# Altium schematic sheet Standby_PS.SchDoc
size A1; SPICEModelCacheYQEDCYZF: <root> / <DocumentId>YQEDCYZF</DocumentId> / </root>
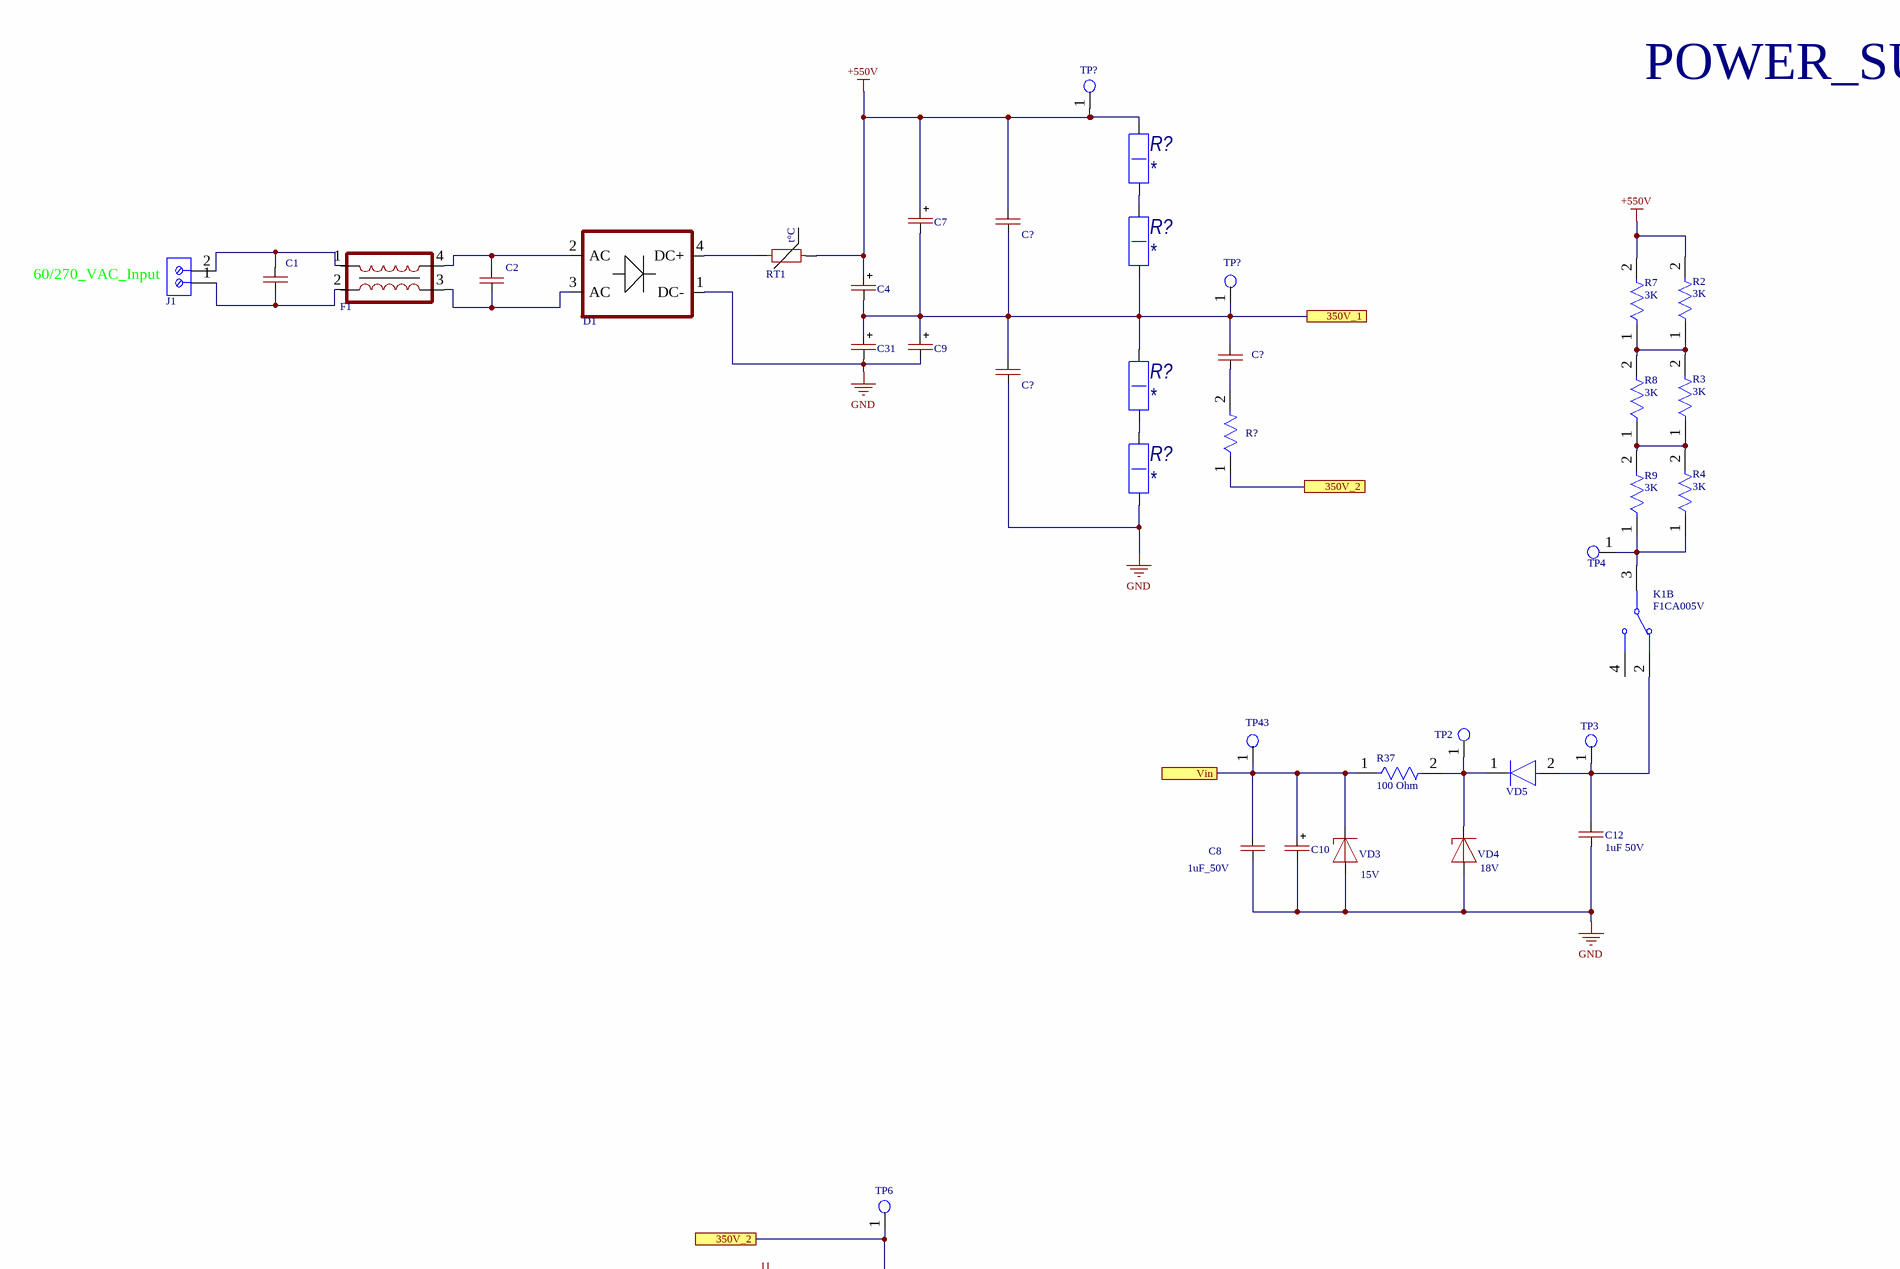
[diagram p0: Standby_PS.SchDoc, top left]
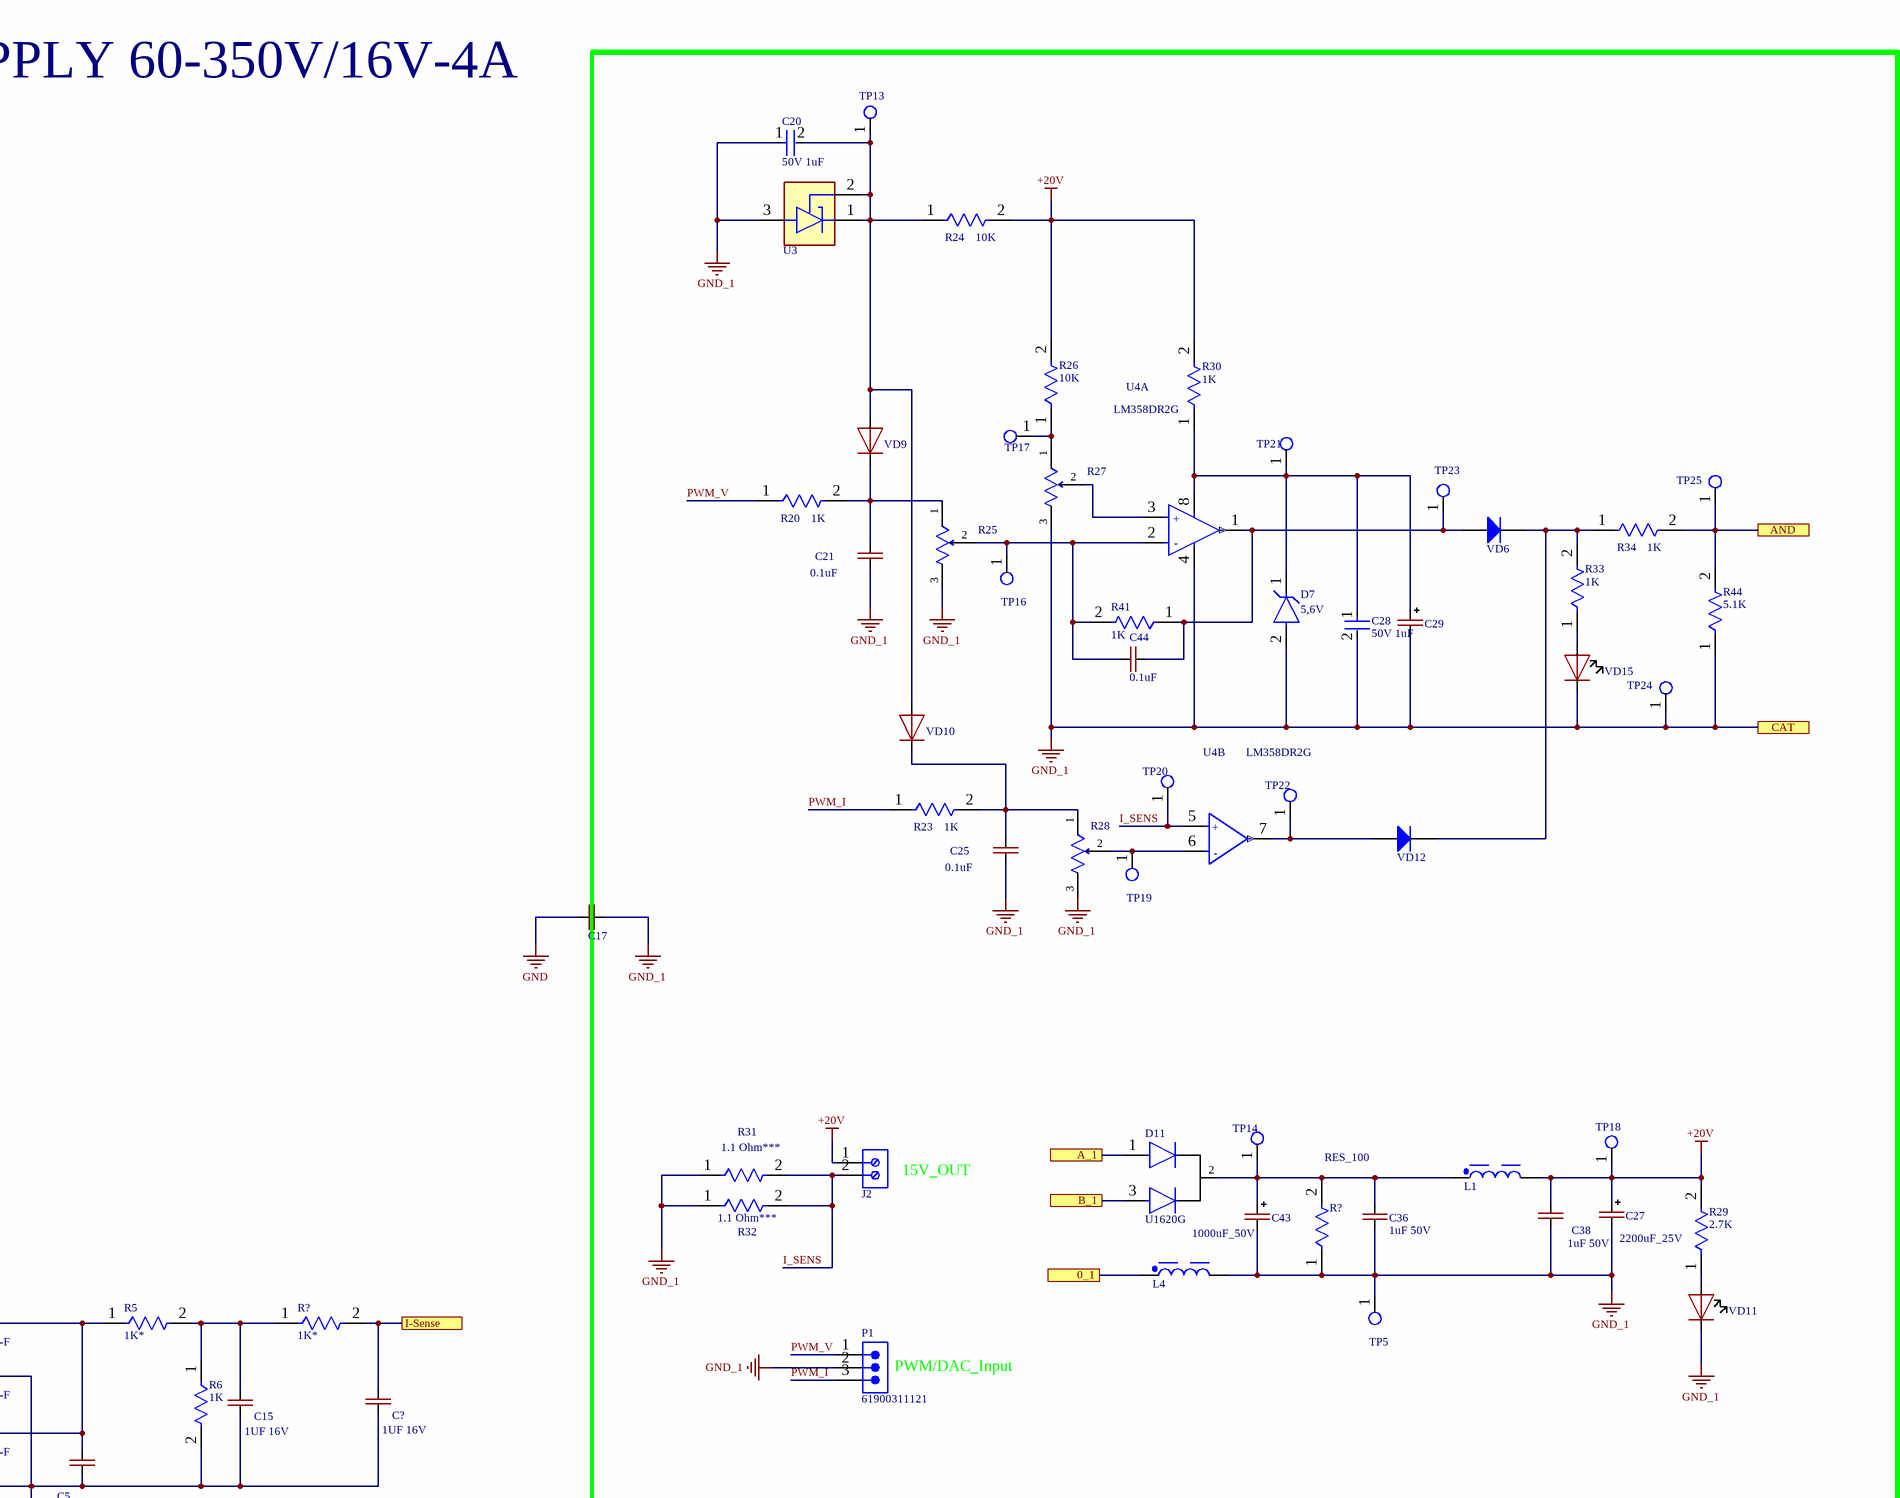
[diagram p1: Standby_PS.SchDoc, top right]
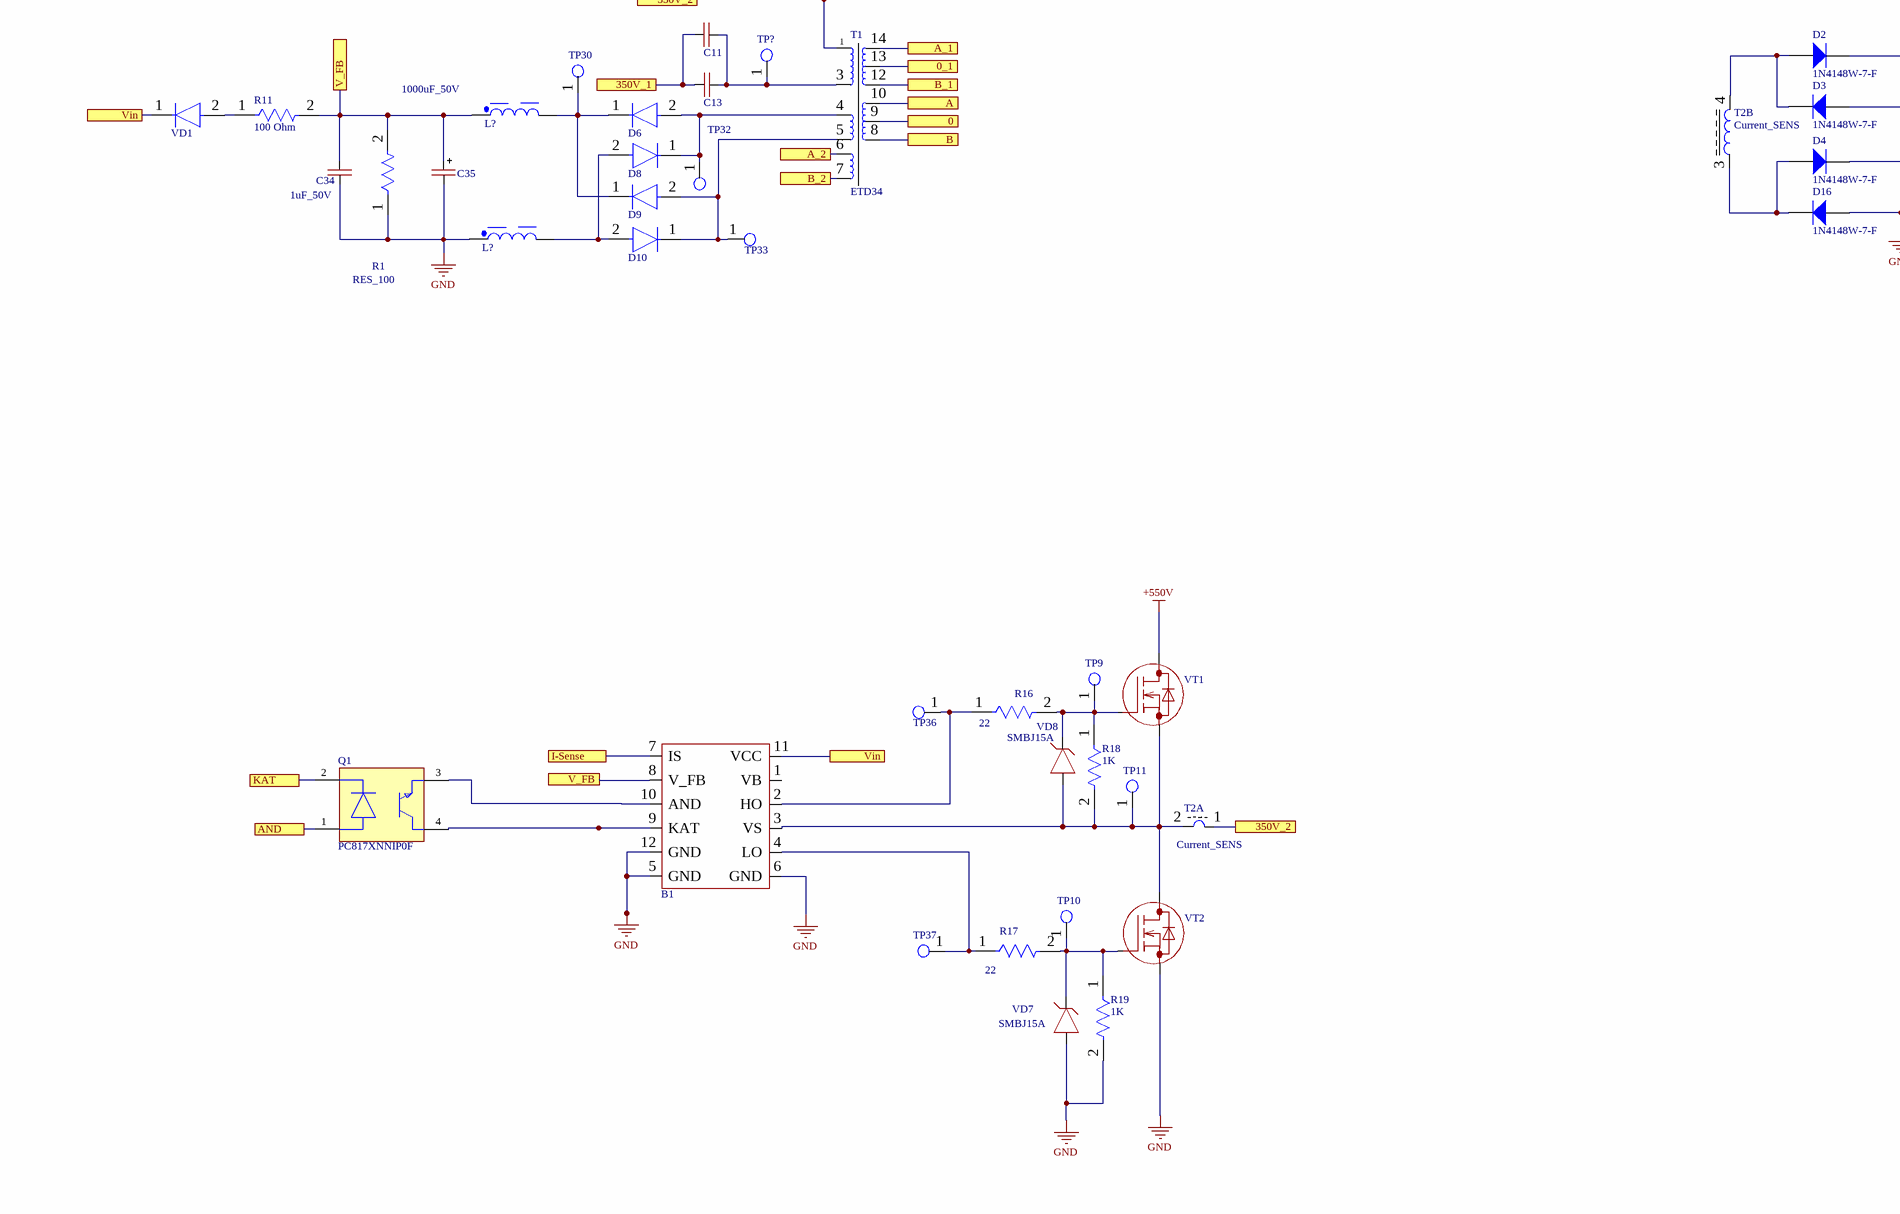
[diagram p2: Standby_PS.SchDoc, bottom left]
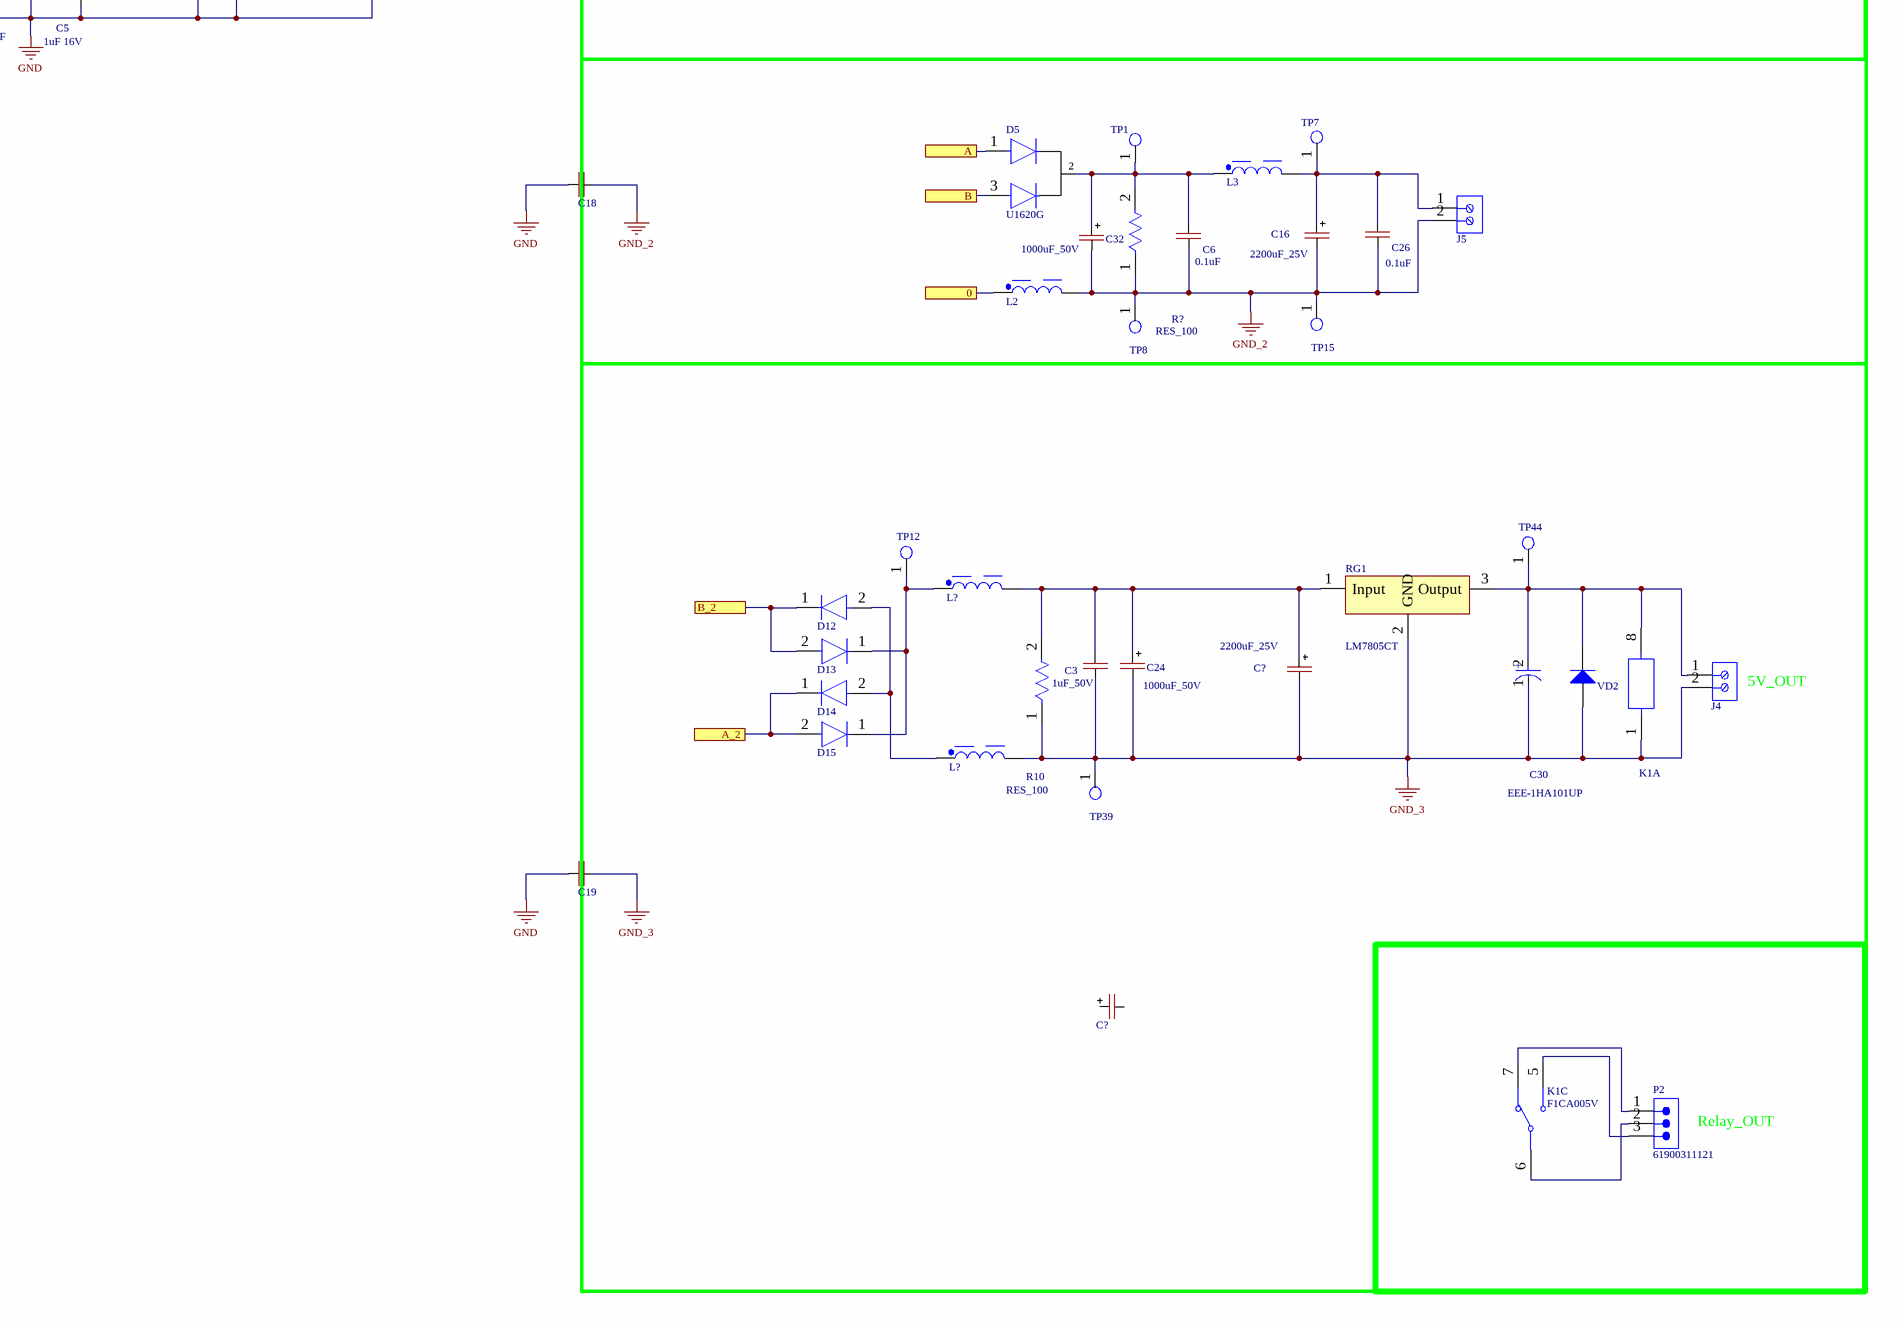
[diagram p3: Standby_PS.SchDoc, bottom right]

## Parts
(Parts that share a designator on the sheet are numbered #1, #2 ... from top to bottom, then left to right.)
B1  PWM_Controller_Half_Bridge  [PWM_Controller_Half_Bridge]  (value not drawn)
C1  CAP-NON-POLAR  [CAP-V15]  (value not drawn)
C2  CAP-NON-POLAR  [CAP-V15]  (value not drawn)
C3  1uF_50V  [CAP-0805]
C4  CAP-POLAR  [CAP 100uF_500V 22x40mm]  (value not drawn)
C5  1uF 16V  [CAP-0805]
C6  0.1uF  [CAP-0805]
C7  CAP-POLAR  [CAP 100uF_500V 22x40mm]  (value not drawn)
C8  1uF_50V  [CAP-0805]
C9  CAP-POLAR  [CAP 100uF_500V 22x40mm]  (value not drawn)
C10  CAP-POLAR  [CAPPOL-12x25]  (value not drawn)
C11  CAP-NON-POLAR  [CAP_3.3uF_630V]  (value not drawn)
C12  1uF 50V  [CAP-0805]
C13  CAP-NON-POLAR  [CAP_3.3uF_630V]  (value not drawn)
C15  1UF 16V  [CAP-0805]
C16  2200uF_25V  [CAPPOL-12x25]
C17  (no value)  [CAP-V]
C18  (no value)  [CAP-V]
C19  (no value)  [CAP-V]
C20  50V 1uF  [FP-C0805C-DN-IPC_A]
C21  0.1uF  [CAP-0805]
C24  1000uF_50V  [CAPPOL-12x25]
C25  0.1uF  [CAP-0805]
C26  0.1uF  [CAP-0805]
C27  2200uF_25V  [CAPPOL-18x40]
C28  50V 1uF  [FP-C0805C-DN-IPC_A]
C29  CAP-POLAR  [CAP-TAN-C]  (value not drawn)
C30  EEE-1HA101UP  [FP-SF-MFG]
C31  CAP-POLAR  [CAP 100uF_500V 22x40mm]  (value not drawn)
C32  1000uF_50V  [CAP_50V_2200uF]
C34  1uF_50V  [CAP-0805]
C35  1000uF_50V  [CAPPOL-12x25]
C36  1uF 50V  [CAP-0805]
C38  1uF 50V  [CAP-0805]
C43  1000uF_50V  [CAP_50V_2200uF]
C44  0.1uF  [CAP-0805]
C?#1  CAP-NON-POLAR  [CAP_3.3uF_630V]  (value not drawn)
C?#2  CAP-V  [CAP-V]  (value not drawn)
C?#3  CAP-NON-POLAR  [CAP_3.3uF_630V]  (value not drawn)
C?#4  1UF 16V  [CAP-0805]
C?#5  2200uF_25V  [CAPPOL-12x25]
C?#6  CAP-POLAR  [CAPPOL-16x25]  (value not drawn)
D1  RS40X  [RS40X]  (value not drawn)
D2  1N4148W-7-F  [DIOD-SOD123-2_V]
D3  1N4148W-7-F  [DIOD-SOD123-2_V]
D4  1N4148W-7-F  [DIOD-SOD123-2_V]
D5  U1620G  [TO-220_Bended_Rad]
D6  US1G  [DO-214AA]  (value not drawn)
D7  5,6V  [FP-SB-V-3906_04-031_4-MFG]
D8  US1G  [DO-214AA]  (value not drawn)
D9  US1G  [DO-214AA]  (value not drawn)
D10  US1G  [DO-214AA]  (value not drawn)
D11  U1620G  [TO-220_Bended_Rad]
D12  US1G  [DO-214AA]  (value not drawn)
D13  US1G  [DO-214AA]  (value not drawn)
D14  US1G  [DO-214AA]  (value not drawn)
D15  US1G  [DO-214AA]  (value not drawn)
D16  1N4148W-7-F  [DIOD-SOD123-2_V]
F1  FILTER  [FILTER_1]  (value not drawn)
J1  691101710002  [691101710002]  (value not drawn)
J2  (no value)  [691101710002]
J4  691101710002  [691101710002]  (value not drawn)
J5  691101710002  [691101710002]  (value not drawn)
K1  (no value)  [Relay_F1CA005V_Omron]  (parts A,B,C of 3)
L1  1.2µH, 7.4A  [WE-PD2_1054]  (value not drawn)
L2  1.2µH, 7.4A  [WE-PD2_1054]  (value not drawn)
L3  1.2µH, 7.4A  [WE-PD2_1054]  (value not drawn)
L4  1.2µH, 7.4A  [WE-PD2_1054]  (value not drawn)
L?#1  1.2µH, 7.4A  [WE-PD2_1054]  (value not drawn)
L?#2  1.2µH, 7.4A  [WE-PD2_1054]  (value not drawn)
L?#3  1.2µH, 7.4A  [WE-PD2_1054]  (value not drawn)
L?#4  1.2µH, 7.4A  [WE-PD2_1054]  (value not drawn)
P1  61900311121  [61900311121]
P2  61900311121  [61900311121]
Q1  PC817XNNIP0F  [FP-PC817XNNIP0F-MFG]
R1  RES_100  [RES_3W]
R2  3K  [RES-2512]
R3  3K  [RES-2512]
R4  3K  [RES-2512]
R5  1K*  [RES-0805]
R6  1K  [RES-0805]
R7  3K  [RES-2512]
R8  3K  [RES-2512]
R9  3K  [RES-2512]
R10  RES_100  [RES_3W]
R11  100 Ohm  [RES-2W]
R16  22  [RES_SMD_1210_IPC_A]
R17  22  [RES_SMD_1210_IPC_A]
R18  1K  [RES-0805]
R19  1K  [RES-0805]
R20  1K  [RES-0805]
R23  1K  [RES-0805]
R24  10K  [RES-0805]
R25  3296W-1-202LF  [Bourns_3296W_MFG]  (value not drawn)
R26  10K  [RES-0805]
R27  3296W-1-202LF  [Bourns_3296W_MFG]  (value not drawn)
R28  3296W-1-202LF  [Bourns_3296W_MFG]  (value not drawn)
R29  2.7K  [RES-0805]
R30  1K  [RES-0805]
R31  1.1 Ohm***  [RES-2W_2]
R32  1.1 Ohm***  [RES-2W_2]
R33  1K  [RES-0805]
R34  1K  [RES-0805]
R37  100 Ohm  [RES-2W]
R41  1K  [RES-0805]
R44  5.1K  [RES-0805]
R?#1  *  [R-2512]
R?#2  *  [R-2512]
R?#3  *  [R-2512]
R?#4  RES_1210  [RES_SMD_1210_IPC_A]  (value not drawn)
R?#5  *  [R-2512]
R?#6  RES_100  [RES_3W]
R?#7  1K*  [RES-0805]
R?#8  RES_100  [RES_3W]
RG1  LM7805CT  [TO-252]
RT1  RES-TEMP  [RES-V5]  (value not drawn)
T1  ETD34  [Transformer_ETD34]
T2  Current_SENS  [Current_Sense_13x7x5]  (parts A,B of 2)
TP1  Test_Point_PCB  [Test_Point]  (value not drawn)
TP2  Test_Point_PCB  [Test_Point]  (value not drawn)
TP3  Test_Point_PCB  [Test_Point]  (value not drawn)
TP4  Test_Point_PCB  [Test_Point]  (value not drawn)
TP5  Test_Point_PCB  [Test_Point]  (value not drawn)
TP6  (no value)  [Test_Point]
TP7  Test_Point_PCB  [Test_Point]  (value not drawn)
TP8  Test_Point_PCB  [Test_Point]  (value not drawn)
TP9  (no value)  [Test_Point]
TP10  (no value)  [Test_Point]
TP11  (no value)  [Test_Point]
TP12  (no value)  [Test_Point]
TP13  Test_Point_PCB  [Test_Point]  (value not drawn)
TP14  Test_Point_PCB  [Test_Point]  (value not drawn)
TP15  Test_Point_PCB  [Test_Point]  (value not drawn)
TP16  Test_Point_PCB  [Test_Point]  (value not drawn)
TP17  Test_Point_PCB  [Test_Point]  (value not drawn)
TP18  Test_Point_PCB  [Test_Point]  (value not drawn)
TP19  Test_Point_PCB  [Test_Point]  (value not drawn)
TP20  Test_Point_PCB  [Test_Point]  (value not drawn)
TP21  Test_Point_PCB  [Test_Point]  (value not drawn)
TP22  Test_Point_PCB  [Test_Point]  (value not drawn)
TP23  Test_Point_PCB  [Test_Point]  (value not drawn)
TP24  Test_Point_PCB  [Test_Point]  (value not drawn)
TP25  Test_Point_PCB  [Test_Point]  (value not drawn)
TP30  (no value)  [Test_Point]
TP32  (no value)  [Test_Point]
TP33  (no value)  [Test_Point]
TP36  (no value)  [Test_Point]
TP37  (no value)  [Test_Point]
TP39  (no value)  [Test_Point]
TP43  (no value)  [Test_Point]
TP44  (no value)  [Test_Point]
TP?#1  (no value)  [Test_Point]
TP?#2  (no value)  [Test_Point]
TP?#3  (no value)  [Test_Point]
U3  (no value)  [TL431_SOT-23-3(A)]
U4  LM358DR2G  [FP-751-07-IPC_C]  (parts A,B of 2)
VD1  US1G  [US1G_SMA]  (value not drawn)
VD2  (no value)  [DIOD-SOD123-2_V]
VD3  15V  [DO-017AA]
VD4  18V  [DO-017AA]
VD5  US1G  [US1G_SMA]  (value not drawn)
VD6  (no value)  [DIOD-SOD123-2_V]
VD7  SMBJ15A  [DO-214AA]
VD8  SMBJ15A  [DO-214AA]
VD9  DIODE  [SOD-123]  (value not drawn)
VD10  DIODE  [SOD-123]  (value not drawn)
VD11  LED  [LED-0603]  (value not drawn)
VD12  (no value)  [DIOD-SOD123-2_V]
VD15  LED  [LED-0603]  (value not drawn)
VT1  (no value)  [TO-220_Bended_Rad]
VT2  (no value)  [TO-220_Bended_Rad]

## Blocks framed on the sheet
Relay_OUT: K1 P2

## Ports
0, 0_1, 350V_1, 350V_2, A, A_1, A_2, AND, B, B_1, B_2, CAT, I-Sense, KAT, V_FB, Vin

## Nets
+20V: C27.1(+) C38.2 J2.1 L1.2 R24.2 R26.2 R29.2 R30.2 TP18.1(G9)
+550V: C4.1(+) C7.1(+) C?#1.2 R2.2 R7.2 R?#1.2 RT1.1 TP?#1.1(G9) VT1.2(D)
GND: B1.5(GND) B1.6(GND) B1.12(GND) C5.1 C8.2 C9.2(-) C10.2(-) C12.1 C15.1 C17.1 C18.1 C19.1 C31.2(-) C34.2 C35.2(-) C?#3.1 C?#4.1 D1.1(DC-) D3.2(A) D16.2(A) L?#2.1 R1.1 R6.2 R19.2 R?#5.1 VD3.2(A) VD4.2(A) VD7.1(A) VT2.3(S)
GND_1: C17.2 C20.1 C21.1 C25.1 C27.2(-) C28.2 C29.2(-) C36.1 C38.1 C43.2(-) D7.2(A) L4.2 P1.2 R25.3(CW) R27.3(CW) R28.3(CW) R31.1 R32.1 R44.1 R?#6.1 TP5.1(G9) TP24.1(G9) U3.3(A) U4.4(VEE/GND) VD11.1(C) VD15.1(C) ; port CAT
GND_2: C6.1 C16.2(-) C18.2 C26.1 C32.2(-) J5.2 L2.2 R?#8.1 TP8.1(G9) TP15.1(G9)
GND_3: C3.2 C19.2 C24.2(-) C30.1(C) C?#5.2(-) J4.2 K1.1 L?#4.2 R10.1 RG1.2(GND) TP39.1(G9) VD2.2(A)
0: L2.1 T1.9 ; port 0
0_1: L4.1 T1.13 ; port 0_1
350V_1: C4.2(-) C7.2(-) C9.1(+) C11.2 C13.1 C31.1(+) C?#1.1 C?#2.2 C?#3.2 R?#2.1 R?#3.2 TP?#2.1(G9) ; port 350V_1
350V_2: R?#4.1 T1.1 T2.1 TP6.1(G9) ; port 350V_2
A: D5.1(A) T1.10 ; port A
A_1: D11.1(A) T1.14 ; port A_1
A_2: D14.1(C) D15.2(A) T1.6 ; port A_2
AND: Q1.1(A) R34.2 R44.2 TP25.1(G9) ; port AND
B: D5.3(A) T1.8 ; port B
B_1: D11.3(A) T1.12 ; port B_1
B_2: D12.1(C) D13.2(A) T1.7 ; port B_2
I-Sense: B1.7(IS) C?#4.2 R?#7.2 ; port I-Sense
I_SENS: J2.2 R31.2 R32.2 TP20.1(G9) U4.5(INPUT_B+)
KAT: Q1.2(C) ; port KAT
PWM_I: P1.3 R23.1
PWM_V: P1.1 R20.1
V_FB: B1.8(V_FB) C34.1 C35.1(+) L?#1.1 R1.2 R11.2 ; port V_FB
Vin: B1.11(VCC) C8.1 C10.1(+) R37.1 TP43.1(G9) VD1.1(C) VD3.1(C) ; port Vin
NetB1_2: B1.2(HO) R16.1 TP36.1(G9)
NetB1_3: B1.3(VS) R18.2 T2.2 TP11.1(G9) VD8.1(A) VT1.3(S) VT2.2(D)
NetB1_4: B1.4(LO) R17.1 TP37.1(G9)
NetB1_9: B1.9(KAT) Q1.4(C)
NetB1_10: B1.10(AND) Q1.3(E)
NetC1_1: C1.1 F1.2 J1.1
NetC1_2: C1.2 F1.1 J1.2
NetC2_1: C2.1 D1.3(AC) F1.3
NetC2_2: C2.2 D1.2(AC) F1.4
NetC3_1: C3.1 C24.1(+) C?#5.1(+) L?#3.2 R10.2 RG1.1(Input)
NetC5_2: C5.2 D2.1(K) D4.1(K) R5.1
NetC6_2: C6.2 C32.1(+) D5.2(C) L3.1 R?#8.2 TP1.1(G9)
NetC11_1: C11.1 C13.2 T1.3 TP?#3.1(G9)
NetC12_2: C12.2 K1.2 TP3.1(G9) VD5.2(A)
NetC15_2: C15.2 R5.2 R6.1 R?#7.1
NetC16_1: C16.1(+) C26.2 J5.1 L3.2 TP7.1(G9)
NetC20_2: C20.2 R24.1 TP13.1(G9) U3.1(C) U3.2(REF) VD9.2(A) VD10.2(A)
NetC21_2: C21.2 R20.2 R25.1(CCW) VD9.1(C)
NetC25_2: C25.2 R23.2 R28.1(CCW) VD10.1(C)
NetC28_1: C28.1 C29.1(+) D7.1(C) R30.1 TP21.1(G9) U4.8(VCC)
NetC30_2: C30.2(A) J4.1 K1.8 RG1.3(Output) TP44.1(G9) VD2.1(K)
NetC36_2: C36.2 C43.1(+) D11.2(C) L1.1 R?#6.2 TP14.1(G9)
NetC44_1: C44.1 R41.1 TP23.1(G9) U4.1(OUTPUT_A) VD6.2(A)
NetC44_2: C44.2 R25.2(WIPER) R41.2 TP16.1(G9) U4.2(INPUT_A-)
NetC?#2_1: C?#2.1 R?#4.2
NetD1_4: D1.4(DC+) RT1.2
NetD2_2: D2.2(A) D3.1(K) T2.4
NetD4_2: D4.2(A) D16.1(K) T2.3
NetD6_1: D6.1(C) D9.1(C) L?#1.2 TP30.1(G9)
NetD6_2: D6.2(A) D8.1(C) T1.4 TP32.1(G9)
NetD8_2: D8.2(A) D10.2(A) L?#2.2
NetD9_2: D9.2(A) D10.1(C) T1.5 TP33.1(G9)
NetD12_2: D12.2(A) D14.2(A) L?#4.1
NetD13_1: D13.1(C) D15.1(C) L?#3.1 TP12.1(G9)
NetK1_3: K1.3 R4.1 R9.1 TP4.1(G9)
NetK1_5: K1.5 P2.3
NetK1_6: K1.6 P2.2
NetK1_7: K1.7 P2.1
NetR2_1: R2.1 R3.2 R7.1 R8.2
NetR3_1: R3.1 R4.2 R8.1 R9.2
NetR11_1: R11.1 VD1.2(A)
NetR16_2: R16.2 R18.1 TP9.1(G9) VD8.2(C) VT1.1(G)
NetR17_2: R17.2 R19.1 TP10.1(G9) VD7.2(C) VT2.1(G)
NetR26_1: R26.1 R27.1(CCW) TP17.1(G9)
NetR27_2: R27.2(WIPER) U4.3(INPUT_A+)
NetR28_2: R28.2(WIPER) TP19.1(G9) U4.6(INPUT_B-)
NetR29_1: R29.1 VD11.2(A)
NetR33_1: R33.1 VD15.2(A)
NetR33_2: R33.2 R34.1 VD6.1(K) VD12.1(K)
NetR37_2: R37.2 TP2.1(G9) VD4.1(C) VD5.1(C)
NetR?#1_1: R?#1.1 R?#2.2
NetR?#3_1: R?#3.1 R?#5.2
NetTP22_1: TP22.1(G9) U4.7(OUTPUT_B) VD12.2(A)

Not connected (* = marked no-connect by the designer): B1 1(VB); C?#6 1(+) 2(-); K1 4

## Notes on the sheet
- POWER_SUPPLY 60-350V/16V-4A
- (near J1) 60/270_VAC_Input
- (near J2) 15V_OUT
- (near P1) PWM/DAC_Input
- (near J4) 5V_OUT
- (in symbol CMP-1310-00291-2, part A) +; -
- (in symbol CMP-1310-00291-2, part B) +; -
- (in symbol CMP-05427-000015-1) +
- (in symbol RES-TEMP) t°C

## Library data of the parts
C3 C5 C6 C8 C12 C15 C21 C25 C26 C34 C36 C38 C44 C?#4 = CAP-NON-POLAR
C16 C27 C?#5 = CAP-POLAR
C17-C19 = CAP-V
C20 C28 = CMP-1036-04552-2: CAP CER 0.22UF 50V X7R 0805; Manufacturer: KEMET; Manufacturer Part Number: C0805C224K5RACTU; Value: 0.22 μF; Temperature Coefficient: 30ppm/°C; Material: Ceramic; Tolerance: 0.1; ComponentLink2URL: https://content.kemet.com/datasheets/KEM_C1003_C0G_SMD.pdf; Temperature Characteristic: X7R; Device Class L3: Ceramic Capacitors; Lead Free: Yes; Temperature: -55°C to +125°C; RoHS: TRUE; Capacitance: 0.22 μF; Automotive: No; Octopart: https://octopart.com/c0805c224k5ractu-kemet-144670; Temperature Range Low: -55°C; Height: 0.88mm; Device Class L1: Passive Components; Digikey Description: CAP CER 0.22UF 50V X7R 0805; ComponentLink2Description: Datasheet; Mouser Description: CAP CER 0.22UF 50V X7R 0805; Category: Cap; Ipc Land Pattern Name: CAPC200125X78; Temperature Range High: +125°C; Package: C0805C-DN; Device Class L2: Capacitors; Voltage Rating: 50 V
C24 C35 = CAP-POLAR: 1000uF_50V  12x25(13x26mm)
C30 = CMP-05427-000015-1: CAP ALUM 100UF 20% 50V SMD; Manufacturer: Panasonic; Automotive Grade: Grade 3; Leakage Current: 100uA; Dissipation Factor: 0.12%; Life: 2000Hours; Ripple Current: 200mA; Material: Aluminum; ComponentLink2Description: Datasheet; Category: Cap; Voltage Rating: 50V; Value: 100uF; Octopart: https://octopart.com/eee-1ha101up-panasonic-55396734; Digikey Description: CAP ALUM 100UF 20% 50V SMD; Package: SF; RoHS: TRUE; Height: 10.5mm; ComponentLink2URL: https://industrial.panasonic.com/cdbs/www-data/pdf/RDE0000/ABA0000C1145.pdf; Tolerance: 20%; Mouser Description: Cap Aluminum Lytic 100uF 50V 20% (8 X 10.2mm) SMD 200mA 2000h 85C Automotive T/R; Device Class L2: Capacitors; Temperature Range High: +85°C; Lead Free: Yes; Device Class L3: Aluminum Electrolytic Capacitors; Device Class L1: Passive Components; Manufacturer Part Number: EEE-1HA101UP; Temperature: -40°C to +85°C; Automotive: Yes; Capacitance: 100uF; Voltage: 50V; Temperature Range Low: -40°C
C32 C43 = CAP_polar_Hitano
D2-D4 D16 VD2 VD6 VD12 = 1N4148: Fast Switching Diode, 100 V, 0.15 A, -65 to 150 degC, 2-Pin?SOD123, RoHS, Tape and Reel; Recovery Time: 4ns; Brand: DiodesIncorporated; Unit Weight: 0.000353oz; Max Surge Current: 2A; Peak Reverse Voltage: 100V; Ir - Reverse Current: 1uA; Vf - Forward Voltage: 1.25V; Configuration: Single; If - Forward Current: 0.15A; Product Category: Diodes-GeneralPurpose,Power,Switching; Operating Temperature Range: -65Cto+150C; Packaging: Reel; Manufacturer URL: http://www.diodes.com/; Maximum Operating Temperature: +150C; Height: 1.25mm; Minimum Operating Temperature: -65C; Product: SwitchingDiodes; Package URL: http://www.diodes.com/datasheets/ds18004.pdf; Type: SwitchingDiode; Package Reference: SOD123-2; Width: 1.7mm; Datasheet URL: http://www.farnell.com/datasheets/1915529.pdf; Datasheet Version: Rev. 24-2, 10/2013; Series: 1N4148; Factory Pack Quantity: 3000; Length: 2.85mm; RoHS: True; Manufacturer: DiodesIncorporated; Mounting Style: SMD/SMT; Package / Case: SOD-123
D7 = CMP-02541-000026-1: DIODE ZENER 8.2V 500MW DO35; Test Current: 5mA; Tolerance: 2%; Impedance: 7R; ESD Protection: No; Element Configuration: Single; Max Reverse Leakage Current: 100nA; Packaging: Ammo Pack; Case/Package: DO-35; Lead Free: Lead Free; Number of Pins: 2; Min Operating Temperature: -65°C; Contact Plating: Tin; Max Power Dissipation: 500mW; Radiation Hardening: No; Max Operating Temperature: 175°C; Mount: Through Hole; Package Quantity: 30000; Voltage Tolerance: 2%; Series: Automotive, AEC-Q101; Zener Voltage: 8.2V; RoHS Compliant: Yes; Power Dissipation: 500mW
J1 J2 J4 J5 = 691101710002: WR-TBL Series 101 Horizontal Entry Modular, THT, pitch 5mm, 2p; Manufacturer: Wurth Elektronik; Modularity: Yes; Rated Current: 16A; Working Voltage: 250V; ComponentLink1Description: Website Link; ComponentLink1URL: https://www.we-online.com/redexpert/article/691101710002?ad; ComponentLink2Description: Datasheet Link; ComponentLink2URL: https://www.we-online.com/redexpert/spec/691101710002?ad; Manufacturer Part Number: 691101710002; Category: Terminal Blocks; Match Code: WR-TBL; Mount: Through Hole; Operating Temperature Max: 105°C; Operating Temperature Min: -40°C; Packaging: Box; Application: Pressure Clamp; Number of Pins: 2; Number of Rows: 1; Orientation: Horizontal; Pitch: 5mm
K1 = F1CA005V
L1-L4 L?#1-L?#4 = 744776012: WE-PD2 SMT Power Inductor, size 1054, 1.2µH, 7.4A, 0.006Ω; Manufacturer: Wurth Elektronik; Case/Size Code: 1054; DC Resistance: 0.004Ω; Saturation Current: 11A; Self Resonant Frequency: 110MHz; Manufacturer Part Number: 744776012; Category: Unshielded Power Inductors; Match Code: WE-PD2; ComponentLink1Description: Website Link; ComponentLink1URL: https://www.we-online.com/redexpert/article/744776012?ad; ComponentLink2Description: Datasheet Link; ComponentLink2URL: https://www.we-online.com/redexpert/spec/744776012?ad; Mount: Surface Mount; Operating Temperature Max: 125°C; Operating Temperature Min: -40°C; Packaging: Tape and Reel; Length: 10mm; Width: 9mm; Height: 5.4mm; DC Resistance Max: 0.006Ω; Inductance: 1.2µH; Rated Current: 7.4A
P1 P2 = 61900311121: WR-WTB THT Male Vertical Locking Header, pitch 2.54mm, 3pins; Manufacturer: Wurth Elektronik; Contact Resistance: 20mΩ; Rated Current: 3A; Withstanding Voltage: 1000VAC; Working Voltage: 250VAC; ComponentLink1Description: Website Link; ComponentLink1URL: https://www.we-online.com/redexpert/article/61900311121?ad; ComponentLink2Description: Datasheet Link; ComponentLink2URL: https://www.we-online.com/redexpert/spec/61900311121?ad; Pitch: 2.54mm; Packaging: Bag; Gender: Male; Manufacturer Part Number: 61900311121; Category: Wire-to-Board Connectors; Match Code: WR-WTB; Mount: Through Hole; Operating Temperature Max: 105°C; Operating Temperature Min: -40°C; Length: 7.62mm; Width: 5.8mm; Height: 11.5mm; Number of Pins: 3; Number of Rows: 1; Orientation: Vertical
Q1 = CMP-65434-000005-1: OPTOISOLATOR 5KV TRANS 4SMD; Reverse Breakdown Voltage: 6V; Output Current per Channel: 30mA; Power Dissipation: 200mW; Collector-emitter Voltage-Max: 200mV; Max Output Voltage: 80V; Input Current: 50mA; Forward Voltage: 1.4V; Fall Time: 18000ns; Number of Elements: 1; Input Type: DC; Packaging: Tape and Reel; RoHS Compliant: Yes; Contact Plating: Copper; Min Operating Temperature: -30°C; Collector Emitter Saturation Voltage: 200mV; Max Input Current: 50mA; Radiation Hardening: No; Max Collector Current: 50mA; Case/Package: SMD/SMT; Mount: Surface Mount; Output Voltage: 80V; Forward Current: 50mA; Max Power Dissipation: 200mW; Collector Emitter Voltage (VCEO): 80V; Number of Channels: 1; Rise Time: 18000ns; Isolation Voltage: 5kV; Number of Pins: 4; Lead Free: Lead Free; Package Quantity: 2000; Isolation Voltage-Max: 5kV; Max Operating Temperature: 100°C
R1 R10 R?#6 R?#8 = RES_THT
R2-R9 R11 R18-R20 R23 R24 R29 R30 R33 R34 R37 R41 R44 R?#7 = RES-CONST
R16 R17 = RES_1210
R26 = RES-CONST: 1-K
R31 R32 = RES-CONST: 10K
R?#1-R?#3 R?#5 = R2512: Резистор SMD; Tolerance: 5%; ComponentDescription: =ComponentType+', '+ Package +', '+Value+'Ом, ' + Tolerance; ComponentType: Резистор SMD; Package: R-2512; Value: *
RG1 = LM7805CT: REG IC REG LINEAR 5V 1A TO220AB; Manufacturer: Fairchild; Voltage Dropout (Max): 2V @ 1A (Typ); Voltage - Input (Max): 35V; helpURL: https://upverter.com/upn/revision/b27a7358b7dd93a3/; ComponentLink2Description: Datasheet; Temperature: -40°C to +125°C; Package: TO220; Supplier 2: Mouser; Price: 0.384521982769; Supplier 1: Digi-Key; ComponentLink1URL: https://upverter.com/upn/revision/b27a7358b7dd93a3/; Supplier Part Number 2: 512-LM7805CT; Supplier Part Number 1: LM7805CT-ND; ComponentLink1Description: Upverter; ComponentLink2URL: https://www.fairchildsemi.com/datasheets/LM/LM7805.pdf; RoHS: TRUE; Mouser Part Number: 512-LM7805CT; Ipc Land Pattern Name: TO-220; Temperature Range High: +125°C; Digikey Description: REG IC REG LINEAR 5V 1A TO220AB; Digikey Part Number: LM7805CT-ND; Lead Free: yes; Temperature Range Low: -40°C; Voltage - Output: 5V; Current-Output: 1A; Part Number: LM7805CT
TP1-TP25 TP30 TP32 TP33 TP36 TP37 TP39 TP43 TP44 TP?#1-TP?#3 = TP_PCB?: Test_Point
U3 = TL431_SOT-23-3
U4 = CMP-1310-00291-2: IC OPAMP GP 2 CIRCUIT 8SOIC; Gain Bandwidth Product: 1MHz; Number of Circuits: 2; Min Supply Voltage: 3V; Slew Rate: 0.6V/µs; Max Dual Supply Voltage: 16V; Common Mode Rejection Ratio: 65dB; Input Bias Current: 250nA; Min Dual Supply Voltage: 1.5V; Dual Supply Voltage: 9V; Operating Supply Current: 1.5mA; Output Current: 40mA; Input Offset Voltage (Vos): 7mV; Nominal Supply Current: 1.2mA; Voltage Gain: 100dB; Max Supply Voltage: 32V; Width: 4mm; Number of Pins: 8; Min Operating Temperature: 0°C; REACH SVHC: No SVHC; Contact Plating: Tin; Lead Free: Lead Free; Halogen Free: Halogen Free; Power Supply Rejection Ratio (PSRR): 65dB; Operating Supply Voltage: 16V; Package Quantity: 2500; Max Operating Temperature: 70°C; Case/Package: SOIC; Height: 1.5mm; Packaging: Tape and Reel; Radiation Hardening: No; Number of Channels: 2; Bandwidth: 1MHz; Length: 5mm; Number of Elements: 2; Number of Amplifiers: 2; Output Current per Channel: 40mA
VD3 VD4 = ZENER
VT1 VT2 = MOSFET-N-GDS